# Altium schematic sheet Connectors.SchDoc
size A4; SheetNumber: 4; SheetTotal: 4
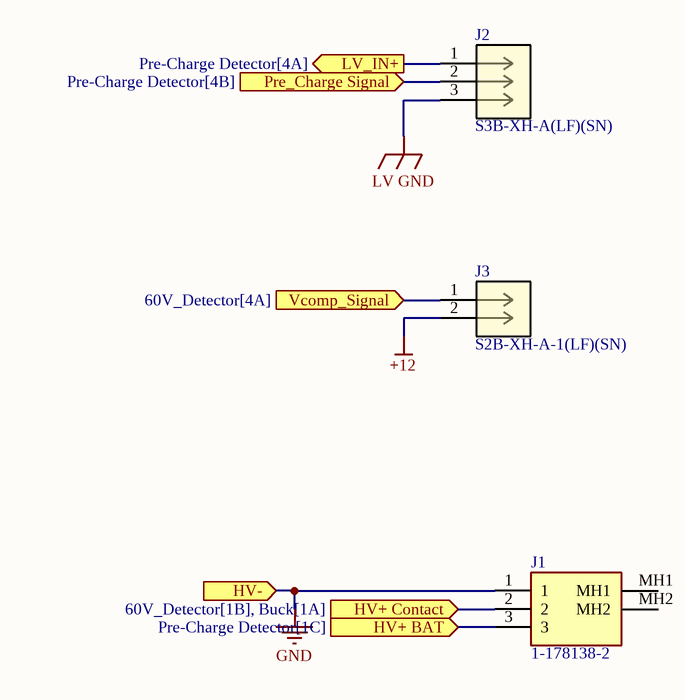
[diagram p0: Connectors.SchDoc]

## Parts
J1  1-178138-2  [11781382]
J2  S3B-XH-A(LF)(SN)  [3P JST XH2.54mm 90º]
J3  S2B-XH-A-1(LF)(SN)  [2P JST XH2.54mm 90º]

## Ports
HV+ BAT (in, see Pre-Charge Detector[1C]), HV+ Contact (in, see 60V_Detector[1B], Buck[1A]), HV- (in), LV_IN+ (out, see Pre-Charge Detector[4A]), Pre_Charge Signal (in, see Pre-Charge Detector[4B]), Vcomp_Signal (in, see 60V_Detector[4A])

## Nets
+12: J3.2
GND: J1.1 ; port HV-
LV GND: J2.3
HV+ BAT: J1.3 ; port HV+ BAT
HV+ Contact: J1.2 ; port HV+ Contact
LV_IN+: J2.1 ; port LV_IN+
Pre_Charge Signal: J2.2 ; port Pre_Charge Signal
Vcomp_Signal: J3.1 ; port Vcomp_Signal

Not connected (* = marked no-connect by the designer): J1 MH1 MH2

## Library data of the parts
J1 = 1-178138-2: Connector; Manufacturer_Name: TE Connectivity; Datasheet Link: https://www.te.com/commerce/DocumentDelivery/DDEController?Action=showdoc&DocId=Customer+Drawing%7F178138%7FE1%7Fpdf%7FEnglish%7FENG_CD_178138_E1.pdf%7F1-178138-2; Height: 11.25mm; Manufacturer_Part_Number: 1-178138-2; Mouser Part Number: 571-1-178138-2; Mouser Price/Stock: https://www.mouser.co.uk/ProductDetail/TE-Connectivity/1-178138-2?qs=CUq%2FfiVWgpCdbQR47qZ9jg%3D%3D; Arrow Part Number: 1-178138-2; Arrow Price/Stock: https://www.arrow.com/en/products/1-178138-2/te-connectivity?region=europe
J2 = 3P JST XH2.54mm 90º: No Description Available; Mfr_Name: JST; Copyright: Copyright (C) 2024 Ultra Librarian. All rights reserved.; Manufacturer_Part_Number: S3B-XH-A(LF)(SN); RefDes: RefDes; Type: DEV
J3 = 2P JST XH2.54mm 90º: No Description Available; Mfr_Name: JST; Copyright: Copyright (C) 2024 Ultra Librarian. All rights reserved.; Manufacturer_Part_Number: S2B-XH-A-1(LF)(SN); RefDes: RefDes; Type: DEV